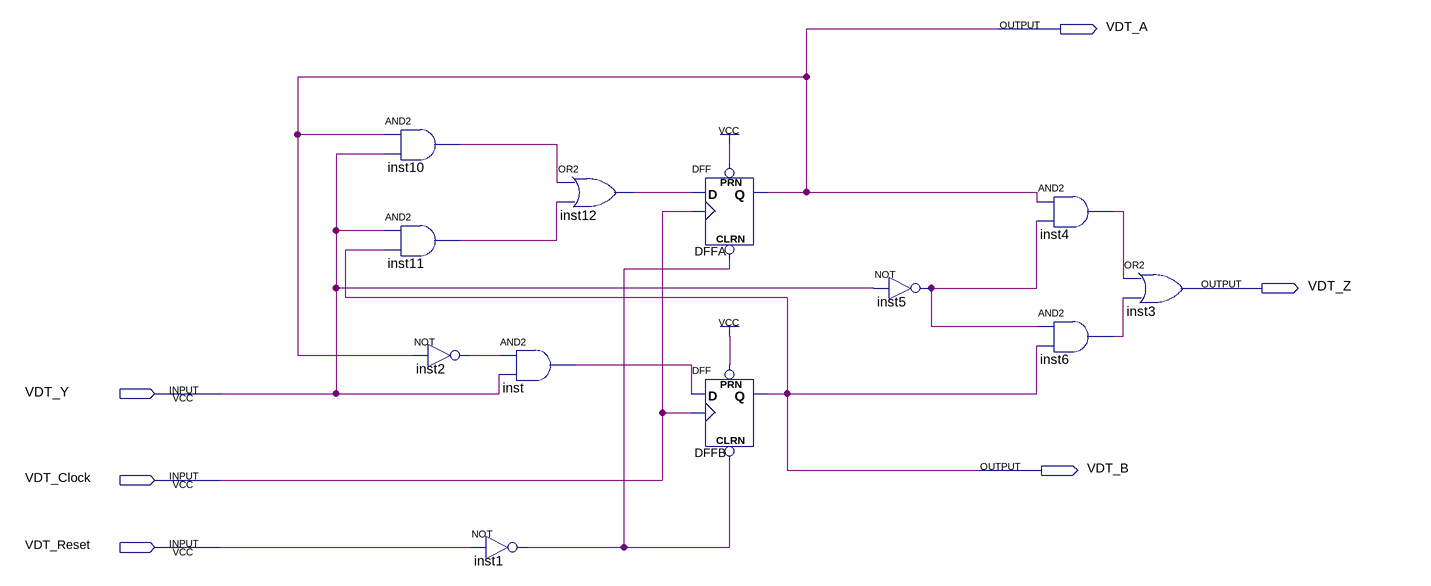
[diagram p0: schematic sheet]
// Quartus schematic assignment2.bdf as structural Verilog: 12 symbols, 6 pins
module assignment2 (
  input  VDT_Y,
  input  VDT_Clock,
  input  VDT_Reset,
  output VDT_A,
  output VDT_Z,
  output VDT_B
);

  wire inst1_out, inst2_out, inst4_out, inst5_out, inst6_out, inst10_out, inst11_out, inst12_out, inst_out;

  and inst10 (inst10_out, VDT_A, VDT_Y);
  and inst11 (inst11_out, VDT_Y, VDT_B);
  not inst2 (inst2_out, VDT_A);
  and inst (inst_out, inst2_out, VDT_Y);
  not inst1 (inst1_out, VDT_Reset);
  or inst12 (inst12_out, inst10_out, inst11_out);
  DFF DFFA (.CLRN(inst1_out), .CLK(VDT_Clock), .D(inst12_out), .PRN(1'b1), .Q(VDT_A));
  DFF DFFB (.CLRN(inst1_out), .CLK(VDT_Clock), .D(inst_out), .PRN(1'b1), .Q(VDT_B));
  not inst5 (inst5_out, VDT_Y);
  and inst4 (inst4_out, VDT_A, inst5_out);
  and inst6 (inst6_out, inst5_out, VDT_B);
  or inst3 (VDT_Z, inst4_out, inst6_out);
endmodule
